# Altium schematic sheet Schematic-ver1.SCHDOC
size A4
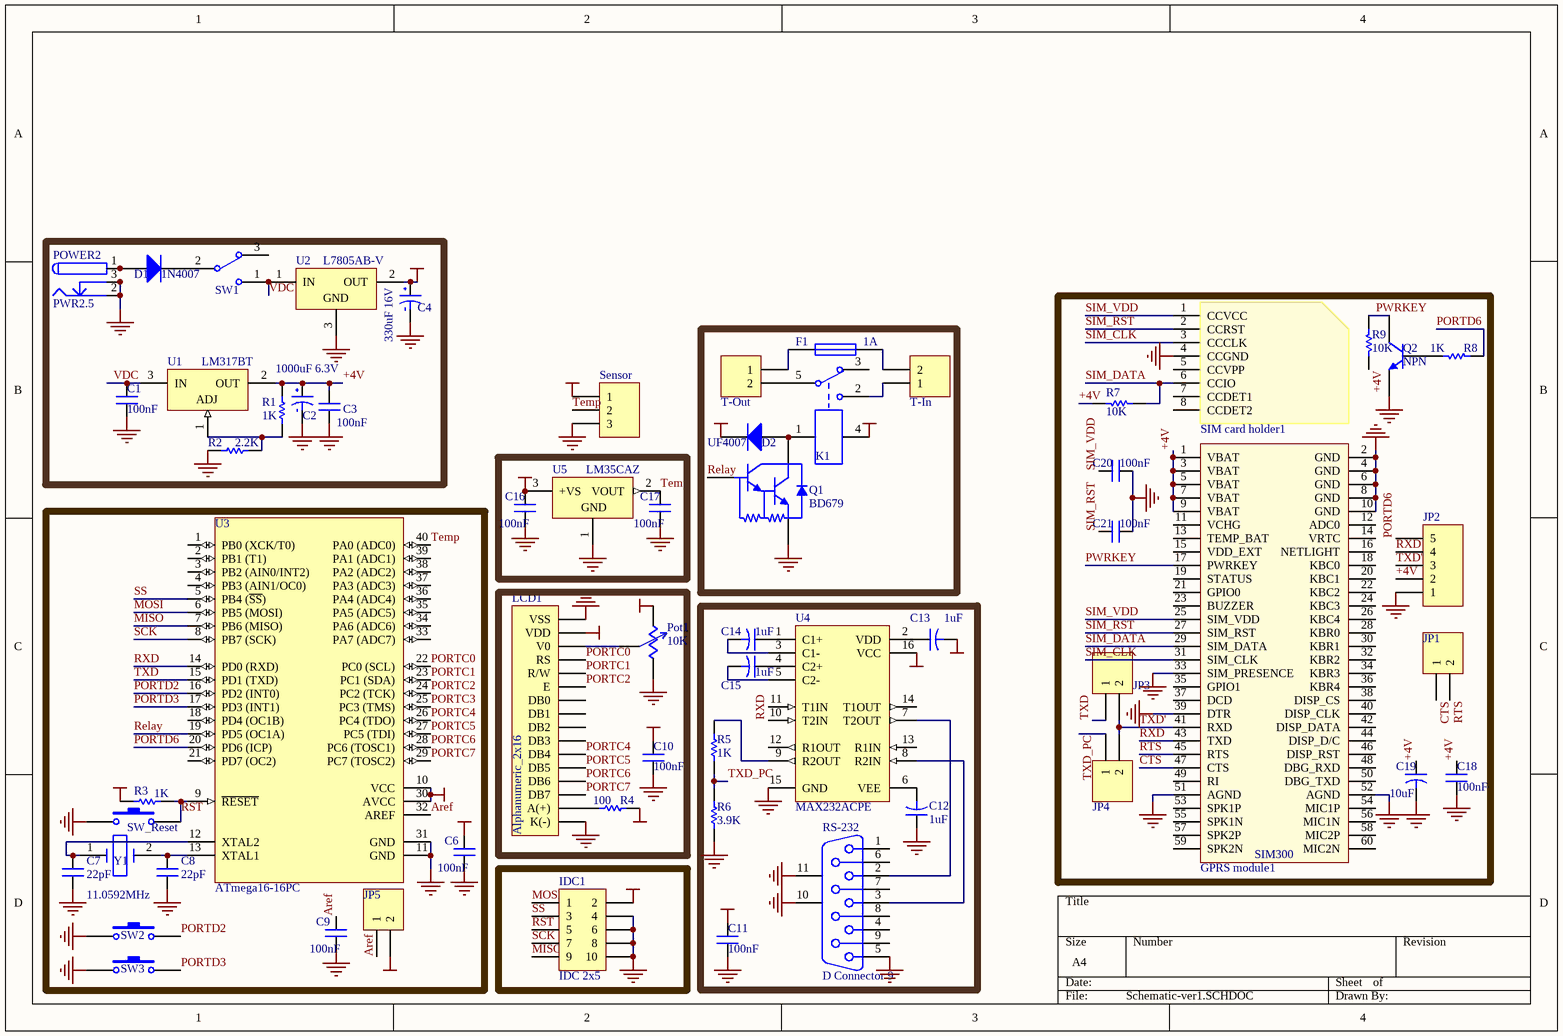
[diagram p0: Schematic-ver1.SCHDOC]

## Parts
C1  Cap_Ceramic  [Cap_Ceramic]  (value not drawn)
C2  Cap_5mm  [Cap_5mm]  (value not drawn)
C3  Cap_Ceramic  [Cap_Ceramic]  (value not drawn)
C4  Cap_4mm  [Cap_4mm]  (value not drawn)
C6  Cap_Tantalium  [Cap_Ceramic]  (value not drawn)
C7  Cap_Ceramic  [Cap_Ceramic]  (value not drawn)
C8  Cap_Ceramic  [Cap_Ceramic]  (value not drawn)
C9  Cap_Tantalium  [Cap_Ceramic]  (value not drawn)
C10  Cap_Tantalium  [Cap_Ceramic]  (value not drawn)
C11  Cap_Tantalium  [Cap_Ceramic]  (value not drawn)
C12  Cap_Small  [Cap_Small]  (value not drawn)
C13  Cap_Small  [Cap_Small]  (value not drawn)
C14  Cap_Small  [Cap_Small]  (value not drawn)
C15  Cap_Small  [Cap_Small]  (value not drawn)
C16  Cap_Tantalium  [Cap_Ceramic]  (value not drawn)
C17  Cap_Tantalium  [Cap_Ceramic]  (value not drawn)
C18  Cap_Tantalium  [Cap_Ceramic]  (value not drawn)
C19  Cap_Small  [Cap_Small]  (value not drawn)
C20  Cap_Tantalium  [Cap_Ceramic]  (value not drawn)
C21  Cap_Tantalium  [Cap_Ceramic]  (value not drawn)
D1  1N4007  [Diode 1N4001]
D2  UF4007  [Diode 1N4001]
F1  Fuse2  [Fuse2]  (value not drawn)
GPRS_module1  SIM300  [SIM300]
IDC1  IDC 2x5  [IDC 2x5]
JP1  Header 2  [HDR1X2]  (value not drawn)
JP2  Header 5H  [HDR1X5H]  (value not drawn)
JP3  Header 2  [HDR1X2]  (value not drawn)
JP4  Header 2  [HDR1X2]  (value not drawn)
JP5  Header 2  [HDR1X2]  (value not drawn)
K1  Relay  [Relay_2]  (value not drawn)
LCD1  Alphanumeric_2x16  [LCD_Alphanumeric_2x16]
Pot1  Rpot  [POT1]  (value not drawn)
POWER2  PWR2.5  [KLD-0202]
Q1  BD679  [BD679]
Q2  NPN  [BCY-W3]
R1  value 1K  [AXIAL-0.3]  (hidden comment: Res1)
R2  value 2.2K  [AXIAL-0.3]  (hidden comment: Res1)
R3  value 1K  [AXIAL-0.3]  (hidden comment: Res1)
R4  value 100  [AXIAL-0.3]  (hidden comment: Res1)
R5  value 1K  [AXIAL-0.3]  (hidden comment: Res1)
R6  value 3.9K  [AXIAL-0.3]  (hidden comment: Res1)
R7  value 10K  [AXIAL-0.3]  (hidden comment: Res1)
R8  value 1K  [AXIAL-0.3]  (hidden comment: Res1)
R9  value 10K  [AXIAL-0.3]  (hidden comment: Res1)
RS-232  D Connector 9  [DSUB1.385-2H9]
Sensor  Header 3H  [HDR1X3H]  (value not drawn)
SIM_card_holder1  SIM card holder  [SIM card holder]  (value not drawn)
SW1  SW_hammer_3  [SW_hammer_3]  (value not drawn)
SW2  PushButton_small  [PushButton_small]  (value not drawn)
SW3  PushButton_small  [PushButton_small]  (value not drawn)
SW_Reset  PushButton_small  [PushButton_small]  (value not drawn)
T-In  Phonix  [Phonix-2]  (value not drawn)
T-Out  Phonix  [Phonix-2]  (value not drawn)
U1  LM317BT  [221A-06]
U2  L7805AB-V  [TO220ABN]
U3  ATmega16-16PC  [40P6]
U4  MAX232ACPE  [PE16A]
U5  LM35CAZ  [Z03A]
Y1  Xtal  [Xtal 1]  (value not drawn)

## Nets
GND: C1.1 C2.1 C3.1 C4.1 C6.1 C7.1 C8.1 C9.1 C10.1 C11.1 C12.2 C16.1 C17.1 C18.1 C19.1 C20.1 C21.1 GPRS_module1.2(GND) GPRS_module1.4(GND) GPRS_module1.6(GND) GPRS_module1.8(GND) GPRS_module1.10(GND) GPRS_module1.33(SIM_PRESENCE) GPRS_module1.39(DTR) GPRS_module1.51(AGND) GPRS_module1.52(AGND) IDC1.4 IDC1.6 IDC1.8 IDC1.10 JP2.1 LCD1.1(VSS) LCD1.16(K(-)) Pot1.1 POWER2.2 POWER2.2A POWER2.2B POWER2.3 POWER2.3A POWER2.3B Q1.3(E) Q2.3(E) R2.1 R6.1 RS-232.5 RS-232.10(MH1) RS-232.11(MH2) Sensor.3 SIM_card_holder1.4(CCGND) SW2.1 SW3.1 SW_Reset.2 U2.3(GND) U3.11(GND) U3.31(GND) U4.15(GND) U5.1(GND)
VCC: C4.2 C6.2 C10.2 C11.2 C13.1 C16.2 D2.K IDC1.2 JP5.2 K1.4 LCD1.2(VDD) Pot1.2 R3.1 R4.2 Sensor.1 U2.2(OUT) U3.10(VCC) U3.30(AVCC) U4.16(VCC) U5.3(+VS)
+4V: C2.2 C3.2 C18.2 C19.2 GPRS_module1.1(VBAT) GPRS_module1.3(VBAT) GPRS_module1.5(VBAT) GPRS_module1.7(VBAT) GPRS_module1.9(VBAT) JP2.2 R1.1 R7.1 R9.2 U1.2(OUT)
Aref: C9.2 JP5.1 U3.32(AREF)
CTS: GPRS_module1.47(CTS) JP1.1
MISO: IDC1.9 U3.7(PB6_(MISO))
MOSI: IDC1.1 U3.6(PB5_(MOSI))
PORTC0: LCD1.4(RS) U3.22(PC0_(SCL))
PORTC1: LCD1.5(R/W) U3.23(PC1_(SDA))
PORTC2: LCD1.6(E) U3.24(PC2_(TCK))
PORTC3: U3.25(PC3_(TMS))
PORTC4: LCD1.11(DB4) U3.26(PC4_(TDO))
PORTC5: LCD1.12(DB5) U3.27(PC5_(TDI))
PORTC6: LCD1.13(DB6) U3.28(PC6_(TOSC1))
PORTC7: LCD1.14(DB7) U3.29(PC7_(TOSC2))
PORTD2: SW2.2 U3.16(PD2_(INT0))
PORTD3: SW3.2 U3.17(PD3_(INT1))
PORTD6: JP2.5 R8.1 U3.20(PD6_(ICP))
PWRKEY: GPRS_module1.17(PWRKEY) Q2.1(C) R9.1
Relay: Q1.1(B) U3.19(PD5_(OC1A))
RST: IDC1.5 R3.2 SW_Reset.1 U3.9(~{RESET})
RTS: GPRS_module1.45(RTS) JP1.2
RXD: GPRS_module1.43(TXD) JP2.4 U3.14(PD0_(RXD)) U4.10(T2IN)
SCK: IDC1.7 U3.8(PB7_(SCK))
SIM_CLK: GPRS_module1.31(SIM_CLK) SIM_card_holder1.3(CCCLK)
SIM_DATA: GPRS_module1.29(SIM_DATA) R7.2 SIM_card_holder1.6(CCIO)
SIM_RST: C21.2 GPRS_module1.27(SIM_RST) SIM_card_holder1.2(CCRST)
SIM_VDD: C20.2 GPRS_module1.25(SIM_VDD) SIM_card_holder1.1(CCVCC)
SS: IDC1.3 U3.5(PB4_(~{SS}))
Temp: C17.2 Sensor.2 U3.40(PA0_(ADC0)) U5.2(VOUT)
TXD: JP3.1 U3.15(PD1_(TXD))
TXD': GPRS_module1.41(RXD) JP2.3 JP3.2 JP4.2
TXD_PC: JP4.1 R5.1 R6.2
VDC: C1.2 SW1.1 U1.3(IN) U2.1(IN)
NetC7_2: C7.2 U3.12(XTAL2) Y1.1
NetC8_2: C8.2 U3.13(XTAL1) Y1.2
NetC12_1: C12.1 U4.6(VEE)
NetC13_2: C13.2 U4.2(VDD)
NetC14_1: C14.1 U4.3(C1-)
NetC14_2: C14.2 U4.1(C1+)
NetC15_1: C15.1 U4.5(C2-)
NetC15_2: C15.2 U4.4(C2+)
NetD1_A: D1.A POWER2.1 POWER2.1A POWER2.1B
NetD1_K: D1.K SW1.2
NetD2_A: D2.A K1.1 Q1.2(C)
NetF1_1: F1.1 T-In.2
NetF1_2: F1.2 T-Out.1
NetK1_2: K1.2 T-In.1
NetK1_5: K1.5 T-Out.2
NetLCD1_3: LCD1.3(V0) Pot1.3
NetLCD1_15: LCD1.15(A(+)) R4.1
NetQ2_2: Q2.2(B) R8.2
NetR1_2: R1.2 R2.2 U1.1(ADJ)
NetR5_2: R5.2 U4.9(R2OUT)
NetRS-232_2: RS-232.2 U4.7(T2OUT)
NetRS-232_3: RS-232.3 U4.8(R2IN)

Not connected (* = marked no-connect by the designer): GPRS_module1 11(VCHG) 12(ADC0) 13(TEMP_BAT) 14(VRTC) 15(VDD_EXT) 16(NETLIGHT) 18(KBC0) 19(STATUS) 20(KBC1) 21(GPIO0) 22(KBC2) 23(BUZZER) 24(KBC3) 26(KBC4) 28(KBR0) 30(KBR1) 32(KBR2) 34(KBR3) 35(GPIO1) 36(KBR4) 37(DCD) 38(DISP_CS) 40(DISP_CLK) 42(DISP_DATA) 44(DISP_D/C) 46(DISP_RST) 48(DBG_RXD) 49(RI) 50(DBG_TXD) 53(SPK1P) 54(MIC1P) 55(SPK1N) 56(MIC1N) 57(SPK2P) 58(MIC2P) 59(SPK2N) 60(MIC2N); K1 3; LCD1 7(DB0) 8(DB1) 9(DB2) 10(DB3); RS-232 1 4 6 7 8 9; SIM_card_holder1 5(CCVPP) 7(CCDET1) 8(CCDET2); SW1 3; U3 1(PB0_(XCK/T0)) 2(PB1_(T1)) 3(PB2_(AIN0/INT2)) 4(PB3_(AIN1/OC0)) 18(PD4_(OC1B)) 21(PD7_(OC2)) 33(PA7_(ADC7)) 34(PA6_(ADC6)) 35(PA5_(ADC5)) 36(PA4_(ADC4)) 37(PA3_(ADC3)) 38(PA2_(ADC2)) 39(PA1_(ADC1)); U4 11(T1IN) 12(R1OUT) 13(R1IN) 14(T1OUT)

## Notes on the sheet
- (in symbol Cap_4mm) 330uF 16V
- (in symbol Cap_5mm) 1000uF 6.3V
- (in symbol Cap_Ceramic) 100nF; 22pF
- (in symbol Cap_Small) 10uF; 1uF
- (in symbol Fuse2) 1A
- (in symbol POT1) 10K
- (in symbol Xtal 1) 11.0592MHz

## Library data of the parts
C6 C9-C11 C16-C18 C20 C21 = Cap_Ceramic
D1 D2 = Diode 1N4001
JP1 JP3-JP5 = Header 2: Header, 2-Pin; Revision: 17-Jul-2002: Re-released for DXP Platform.; Publisher: Altium Limited
JP2 = Header 5H: Header, 5-Pin, Right Angle; Revision: 17-Jul-2002: Re-released for DXP Platform.; Publisher: Altium Limited
K1 = Relay_2
LCD1 = LCD_Alphanumeric_2x16
Pot1 = POT1
POWER2 = PWR2.5: Low Voltage Power Supply Connector; Published: 17-Dec-2003; Datasheet: Latest Revision: 09-May-2002; Publisher: Altium Limited
Q2 = NPN: NPN Bipolar Transistor; Code - JEDEC: TO-226-AA; Published: 8-Jun-2000; Revision: July-2002: Re-released for DXP Platform.; Publisher: Altium Limited
R1-R9 = Res1: Resistor; Published: 8-Jun-2000; Revision: July-2002: Re-released for DXP Platform.; Publisher: Altium Limited
RS-232 = D Connector 9: Receptacle Assembly, 9 Position, Right Angle; Package Information: Latest Revision: O; Positions: 9; Published: 15-Jun-2001; Revision: 17-Jul-2002: Re-released for DXP Platform.; Datasheet: (1-Sep-1999); Package Reference: 788750; Publisher: Altium Limited; Orientation: Right Angle; Gender: Receptacle
Sensor = Header 3H: Header, 3-Pin, Right Angle; Revision: 17-Jul-2002: Re-released for DXP Platform.; Publisher: Altium Limited
T-In T-Out = Phonix-2
U1 = LM317BT: Three-Terminal Adjustable Output Positive Voltage Regulator; Package Information: Latest Revision: 1997; Note: Heatsink surface connected to Pin 2; Code - JEDEC: TO-262-AA; Published: 15-Apr-2002; Datasheet: Latest Revision: 1996; Package Reference: 221A-06; Publisher: Altium Limited
U2 = L7805AB-V: Precision 1A Regulator; Package Information: Latest Revision: Jun-1998; Note: Tab is connected to pin 3 (GND).; Published: 24-Aug-2001; Revision: 17-Jul-2002: Re-released for DXP Platform.; Datasheet: Latest Revision: Nov-1999; Package Reference: TO220ABN; Publisher: Altium Limited
U3 = ATmega16-16PC: 8-Bit AVR Microcontroller with 16K Bytes of In-System Programmable Flash Memory; Package Information: Latest Revision: Dec-1999; Published: 17-Sep-2003; Datasheet: Latest Revision: 2466E-AVR-10/02; Package Reference: 40P6; Publisher: Altium Limited
U4 = MAX232ACPE: +5V Powered, Multi-Channel RS-232 Driver/Receiver; Package Information: Latest Revision: 1997; Code - JEDEC: MS-001-BB; Published: 16-Jan-2001; Revision: 17-Jul-2002: Re-released for DXP Platform.; Package Reference: PE16A; Publisher: Altium Limited
U5 = LM35CAZ: Precision CentigradeTemperature Sensor; Package Information: Latest Revision: 2000; Published: 15-Apr-2002; Datasheet: Latest Revision: Sep-1997; Package Reference: Z03A; Publisher: Altium Limited
Y1 = Xtal 1